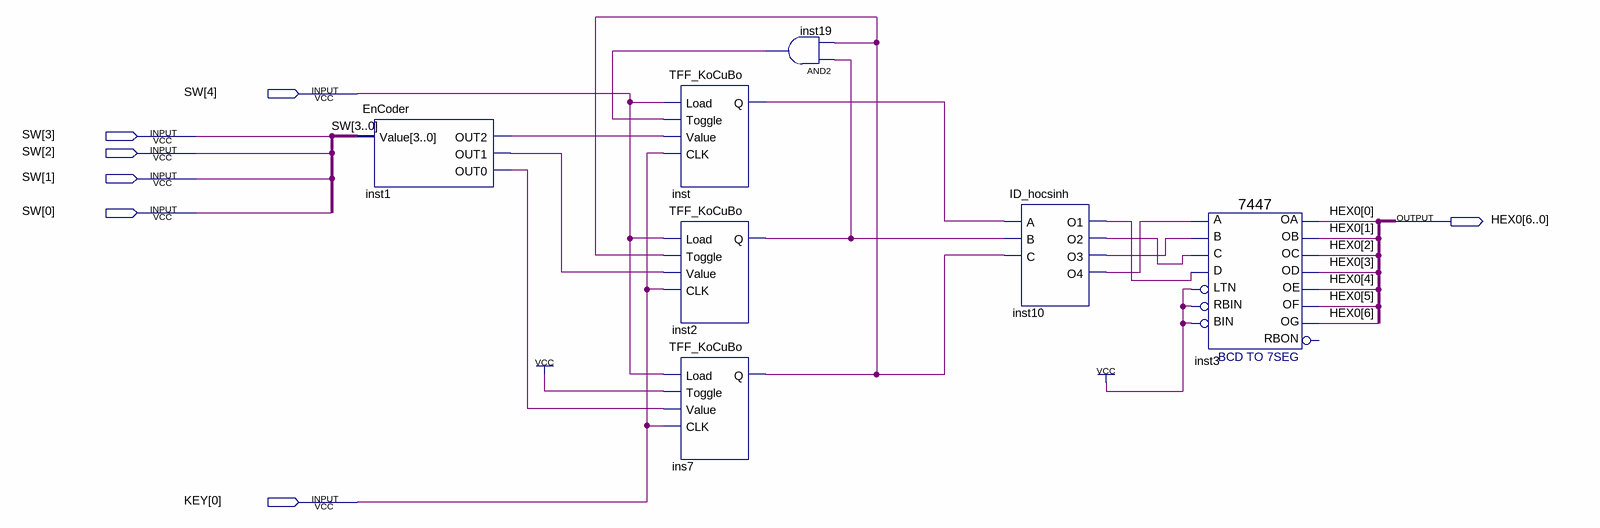
[diagram p0: schematic sheet]
// Quartus schematic Lab_06.bdf as structural Verilog: 7 symbols, 7 pins
module Lab_06 (
  input  [4:0] SW,
  input  [0:0] KEY,
  output [6:0] HEX0
);

  wire ins7_q, inst1_out0, inst1_out1, inst1_out2, inst2_q, inst10_o1, inst10_o2, inst10_o3, inst10_o4,
       inst19_out, inst_q;

  EnCoder inst1 (.Value(SW[3:0]), .OUT2(inst1_out2), .OUT1(inst1_out1), .OUT0(inst1_out0));
  TFF_KoCuBo inst (.Load(SW[4]), .Toggle(inst19_out), .Value(inst1_out2), .CLK(KEY[0]), .Q(inst_q));
  TFF_KoCuBo inst2 (.Load(SW[4]), .Toggle(ins7_q), .Value(inst1_out1), .CLK(KEY[0]), .Q(inst2_q));
  TFF_KoCuBo ins7 (.Load(SW[4]), .Toggle(1'b1), .Value(inst1_out0), .CLK(KEY[0]), .Q(ins7_q));
  and inst19 (inst19_out, inst2_q, ins7_q);
  ID_hocsinh inst10 (
    .A(inst_q), .B(inst2_q), .C(ins7_q), .O1(inst10_o1), .O2(inst10_o2), .O3(inst10_o3), .O4(inst10_o4));
  \7447  inst3 (
    .LTN(1'b1), .B(inst10_o3), .C(inst10_o2), .D(inst10_o1), .RBIN(1'b1), .BIN(1'b1), .A(inst10_o4),
    .OB(HEX0[1]), .OC(HEX0[2]), .OE(HEX0[4]), .OD(HEX0[3]), .OF(HEX0[5]), .OG(HEX0[6]), .OA(HEX0[0]));  // open: RBON
endmodule
